# Altium schematic sheet uC.SchDoc
size 594 x 420 mm; Address1: Address1; Address2: Address2; Address3: Address3; Address4: Address4; SheetNumber: 1; Scale: 1:1; Разраб.: Иванов; Обозначение документа: uC; Пров.: Петров; Утв.: Сидоров; Наименование организации: ОАО "Концерн "МПО-Гидроприбор"; Перв. применение: АБВГ.123456.000; Наименование изделия 1: ujyjyjyj; Наименование изделия 2: Схема электрическая; Наименование изделия 3: принципиальная; Нач. отд.: Нач. отд.; Фамилия нач. отд.: Сидоров
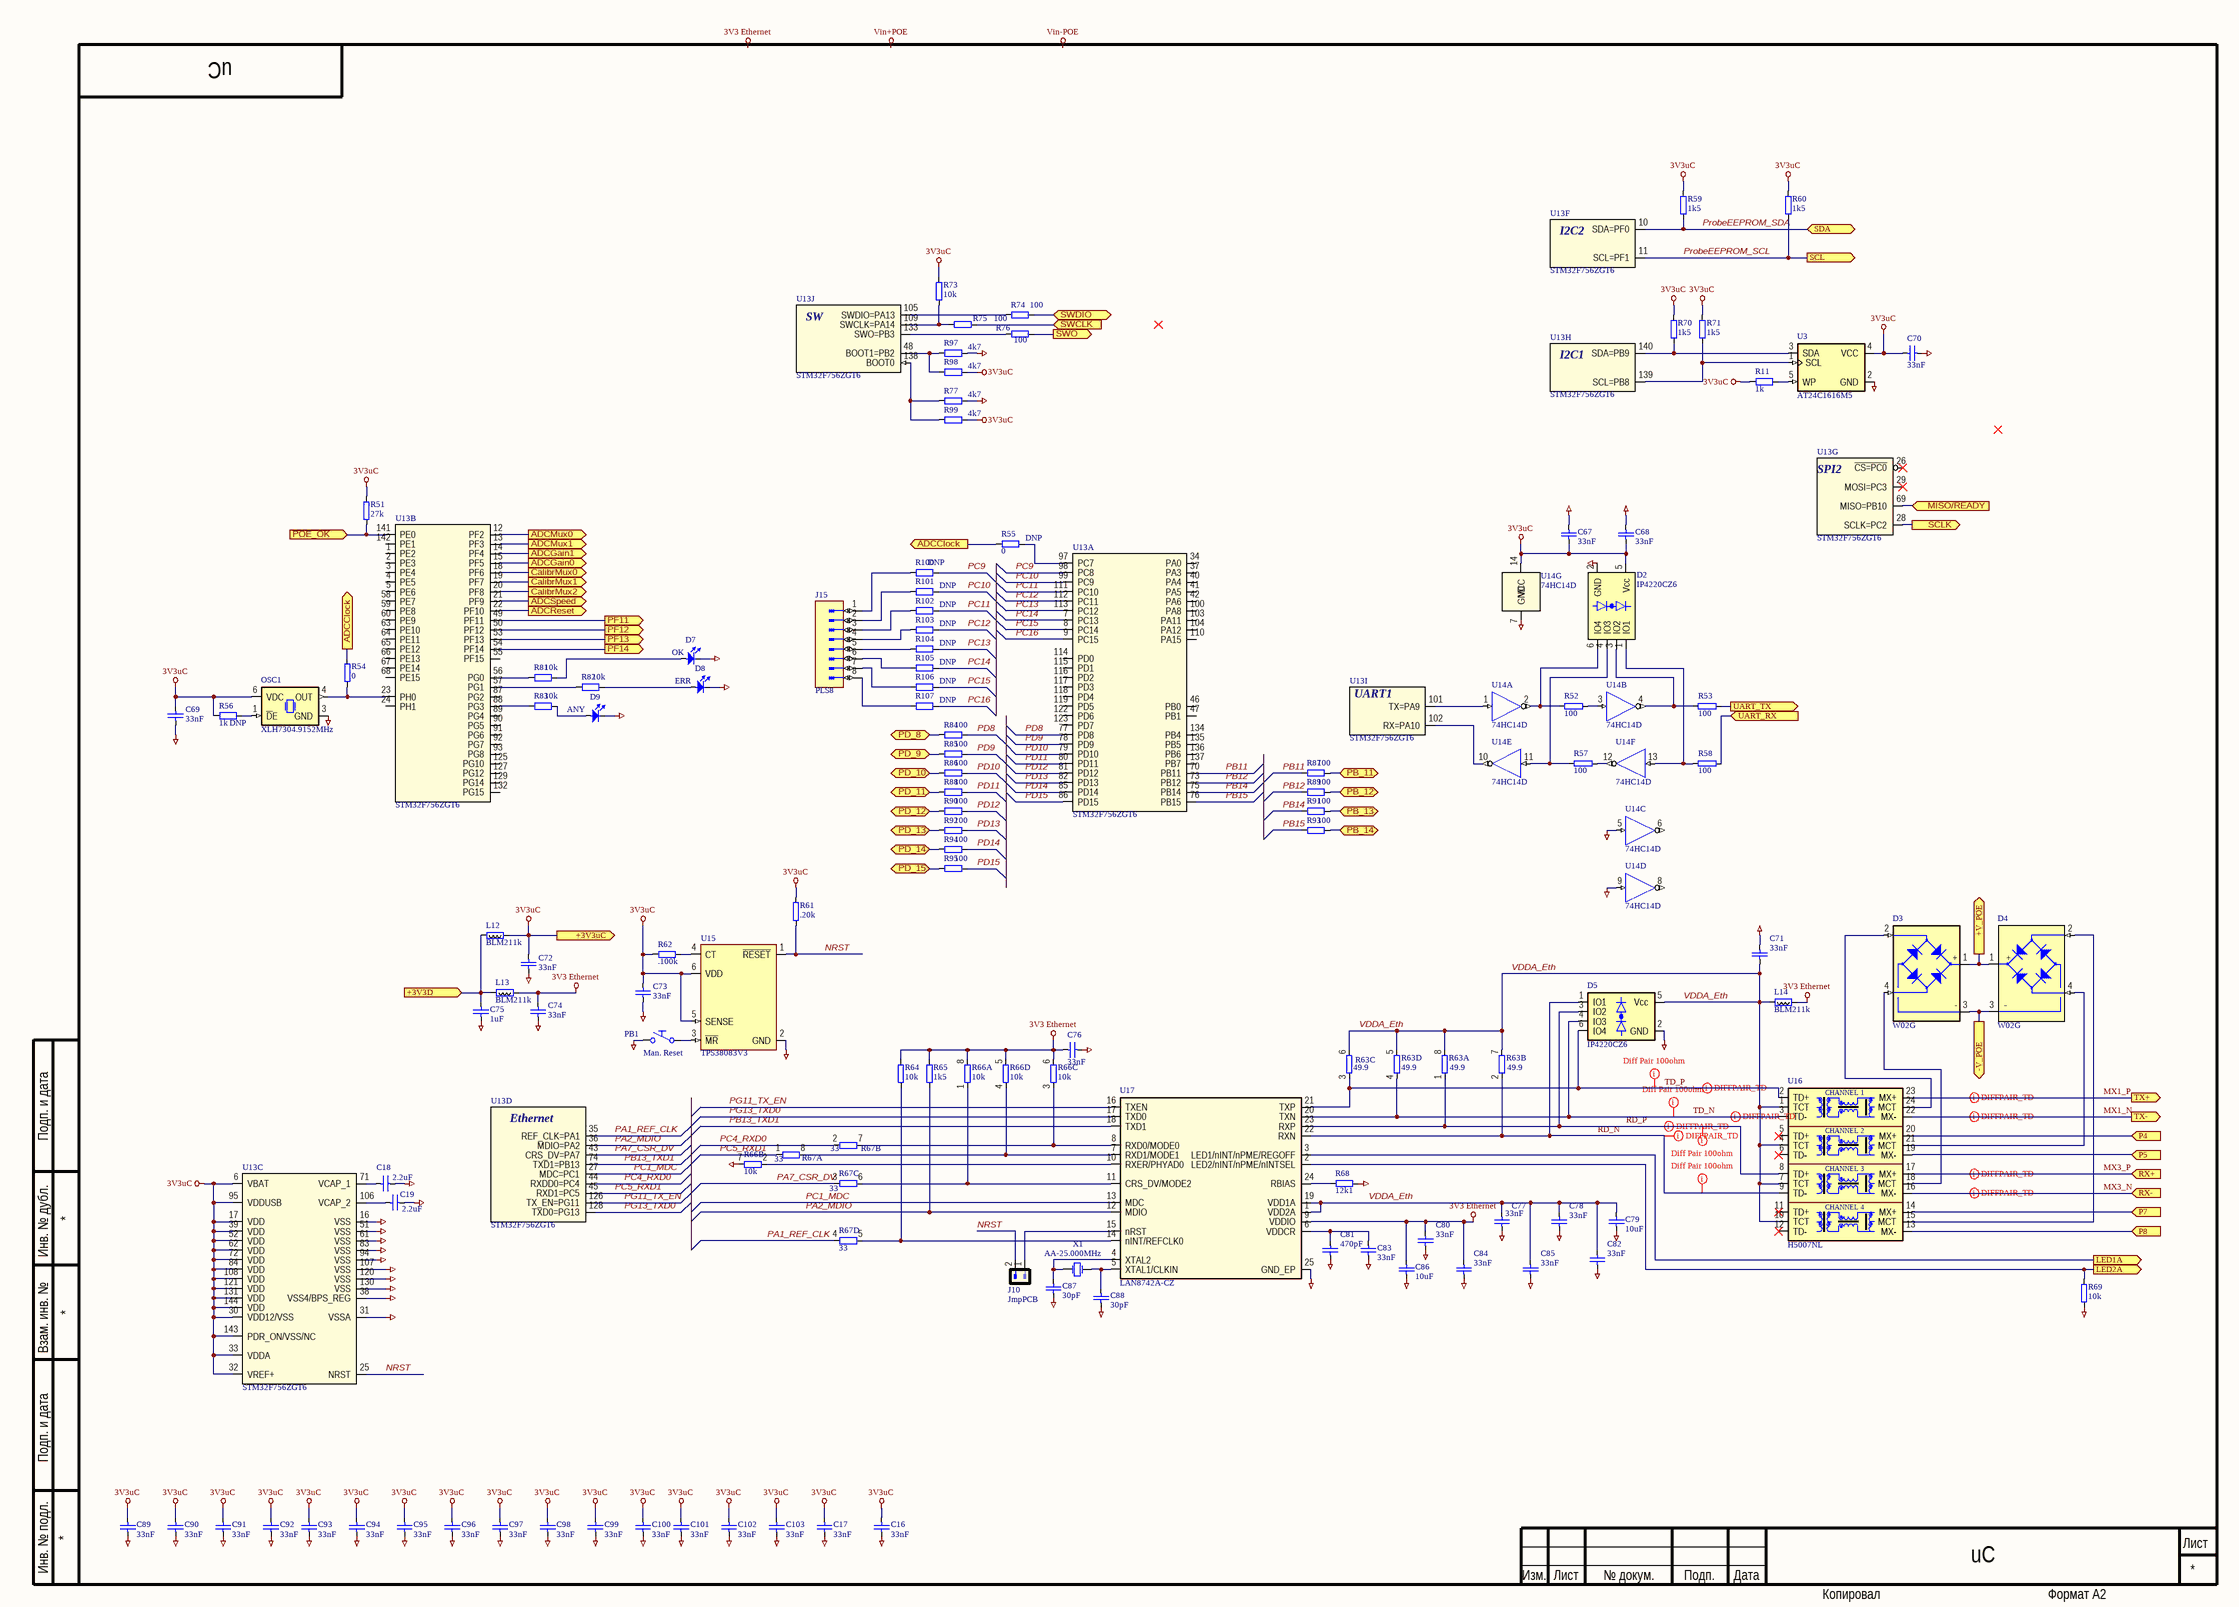
[diagram p0: uC.SchDoc]

## Parts
C16  33nF  [CAPC1608X87N]
C17  33nF  [CAPC1608X87N]
C18  2.2uF  [SMD0805CAP]
C19  2.2uF  [SMD0805CAP]
C67  33nF  [CAPC1608X87N]
C68  33nF  [CAPC1608X87N]
C69  33nF  [CAPC1608X87N]
C70  33nF  [CAPC1608X87N]
C71  33nF  [CAPC1608X87N]
C72  33nF  [CAPC1608X87N]
C73  33nF  [CAPC1608X87N]
C74  33nF  [CAPC1608X87N]
C75  1uF  [CAPC1608X87N]
C76  33nF  [CAPC1608X87N]
C77  33nF  [CAPC1608X87N]
C78  33nF  [CAPC1608X87N]
C79  10uF  [SMD0805CAP]
C80  33nF  [CAPC1608X87N]
C81  470pF  [CAPC1608X87N]
C82  33nF  [CAPC1608X87N]
C83  33nF  [CAPC1608X87N]
C84  33nF  [CAPC1608X87N]
C85  33nF  [CAPC1608X87N]
C86  10uF  [SMD0805CAP]
C87  30pF  [CAPC1608X87N]
C88  30pF  [CAPC1608X87N]
C89  33nF  [CAPC1608X87N]
C90  33nF  [CAPC1608X87N]
C91  33nF  [CAPC1608X87N]
C92  33nF  [CAPC1608X87N]
C93  33nF  [CAPC1608X87N]
C94  33nF  [CAPC1608X87N]
C95  33nF  [CAPC1608X87N]
C96  33nF  [CAPC1608X87N]
C97  33nF  [CAPC1608X87N]
C98  33nF  [CAPC1608X87N]
C99  33nF  [CAPC1608X87N]
C100  33nF  [CAPC1608X87N]
C101  33nF  [CAPC1608X87N]
C102  33nF  [CAPC1608X87N]
C103  33nF  [CAPC1608X87N]
D2  IP4220CZ6  [SOT95P270X145-6N]
D3  W02G  [RECTRON_RB15]
D4  W02G  [RECTRON_RB15]
D5  IP4220CZ6  [SOT95P270X145-6N]
D7  OK  [LED_OSRAM_LGR971]
D8  ERR  [LED_OSRAM_LOR976]
D9  ANY  [LED_OSRAM_LYR976]
J10  JmpPCB  [PCBJumper]
J15  PLS8  [COMATEL_386.0358.1.08.440]
L12  BLM211k  [RESC2012X50N]
L13  BLM211k  [RESC2012X50N]
L14  BLM211k  [RESC2012X50N]
OSC1  XLH7304.9152MHz  [OSC_PERICOM_FRETHE025]
PB1  value Man. Reset  [PB_ALPS_SKHHLQA010]  (hidden comment: 2-1825027-0)
R11  1k  [SMD0805RES]
R51  27k  [SMD0805RES]
R52  100  [SMD0805RES]
R53  100  [SMD0805RES]
R54  0  [SMD0805RES]
R55  0  Solder Option: DNP  [SMD0805RES]
R56  1k  Solder Option: DNP  [SMD0805RES]
R57  100  [SMD0805RES]
R58  100  [SMD0805RES]
R59  1k5  [RESC1608X64N]
R60  1k5  [RESC1608X64N]
R61  .20k  [RESC1608X64N]
R62  .100k  [RESC1608X64N]
R63  49.9  [CAY16x4]  (parts A,B,C,D of 4)
R64  10k  [RESC1608X64N]
R65  1k5  [RESC1608X64N]
R66  10k  [CAY16x4]  (parts A,B,C,D of 4)
R67  33  [CAY16x4]  (parts A,B,C,D of 4)
R68  12k1  [RESC1608X64N]
R69  10k  [RESC1608X64N]
R70  1k5  [RESC1608X64N]
R71  1k5  [SMD0805RES]
R73  10k  [SMD0805RES]
R74  100  [SMD0805RES]
R75  100  [SMD0805RES]
R76  100  [SMD0805RES]
R77  4k7  [RESC1608X64N]
R81  10k  [SMD0805RES]
R82  10k  [SMD0805RES]
R83  10k  [SMD0805RES]
R84  100  [SMD0805RES]
R85  100  [SMD0805RES]
R86  100  [SMD0805RES]
R87  100  [SMD0805RES]
R88  100  [SMD0805RES]
R89  100  [SMD0805RES]
R90  100  [SMD0805RES]
R91  100  [SMD0805RES]
R92  100  [SMD0805RES]
R93  100  [SMD0805RES]
R94  100  [SMD0805RES]
R95  100  [SMD0805RES]
R97  4k7  [RESC1608X64N]
R98  4k7  [RESC1608X64N]
R99  4k7  [RESC1608X64N]
R100  DNP  [RESC1608X64N]
R101  DNP  [RESC1608X64N]
R102  DNP  [RESC1608X64N]
R103  DNP  [RESC1608X64N]
R104  DNP  [RESC1608X64N]
R105  DNP  [RESC1608X64N]
R106  DNP  [RESC1608X64N]
R107  DNP  [RESC1608X64N]
U3  AT24C1616M5  [SOT23-5]
U13  STM32F756ZGT6  [LQFP-144_STM-M]  (parts A,B,C,D,F,G,H,I,J of 10)
U14  74HC14D  [SOIC127P600X175-14N]  (parts A,B,C,D,E,F,G of 7)
U15  TPS38083V3  [SOT95P270X145-6N]
U16  H5007NL  [XFMR_PULSE_H5007NL]
U17  LAN8742A-CZ  [QFN24_0R5_4X4]
X1  AA-25.000MHz  [XTAL_AA]

## Ports
+3V3D (in), +3V3uC (out), +V_POE (out), -V_POE (out), ADCClock (out), ADCGain0 (out), ADCGain1 (out), ADCMux0 (out), ADCMux1 (out), ADCReset (out), ADCSpeed (out), CalibrMux0 (out), CalibrMux1 (out), CalibrMux2 (out), LED1A (out), LED2A (out), MISO/READY (in), P4 (in), P5 (in), P7 (in), P8 (in), PB_11 (bidir), PB_12 (bidir), PB_13 (bidir), PB_14 (bidir), PD_8 (bidir), PD_9 (bidir), PD_10 (bidir), PD_11 (bidir), PD_12 (bidir), PD_13 (bidir), PD_14 (bidir), PD_15 (bidir), PF11 (out), PF12 (out), PF13 (out), PF14 (out), RX+ (in), RX- (in), SCL (out), SCLK (out), SDA (bidir), SWCLK (in), SWDIO (bidir), SWO (out), TX+ (out), TX- (out), UART_RX (in), UART_TX (out), ~{POE_OK} (in)

## Nets
3V3 Ethernet: C74.2 C76.2 C80.2 C84.2 C86.2 L13.2 L14.2 R64.1 R65.1 R66.5 R66.6 R66.8 U17.9(VDDIO)
3V3uC: C16.2 C17.2 C67.2 C68.2 C69.2 C70.1 C72.2 C73.2 C89.2 C90.2 C91.2 C92.2 C93.2 C94.2 C95.2 C96.2 C97.2 C98.2 C99.2 C100.2 C101.2 C102.2 C103.2 D2.5(Vcc) L12.2 OSC1.6(VDC) R11.2 R51.2 R56.1 R59.1 R60.1 R61.1 R62.1 R70.2 R71.2 R73.2 R98.2 R99.2 U3.4(VCC) U13.6(VBAT) U13.17(VDD) U13.30(VDD12/VSS) U13.32(VREF+) U13.33(VDDA) U13.39(VDD) U13.52(VDD) U13.62(VDD) U13.72(VDD) U13.84(VDD) U13.95(VDDUSB) U13.108(VDD) U13.121(VDD) U13.131(VDD) U13.143(PDR_ON/VSS/NC) U13.144(VDD) U14.14(VCC) U15.5(SENSE) U15.6(VDD) ; port +3V3uC
GND: C16.1 C17.1 C18.1 C19.1 C67.1 C68.1 C69.1 C70.2 C71.2 C72.1 C73.1 C74.1 C75.1 C76.1 C77.1 C78.1 C79.1 C80.1 C81.1 C82.1 C83.1 C84.1 C85.1 C86.1 C87.2 C88.2 C89.1 C90.1 C91.1 C92.1 C93.1 C94.1 C95.1 C96.1 C97.1 C98.1 C99.1 C100.1 C101.1 C102.1 C103.1 D2.2(GND) D5.2(GND) D7.1(C) D8.1(C) D9.1(C) OSC1.3(GND) PB1.2(NO) R66.7 R68.1 R69.2 R77.2 R97.2 U3.2(GND) U13.16(VSS) U13.31(VSSA) U13.38(VSS4/BPS_REG) U13.51(VSS) U13.61(VSS) U13.83(VSS) U13.94(VSS) U13.107(VSS) U13.120(VSS) U13.130(VSS) U14.5(IN) U14.7(GND) U14.9(IN) U15.2(GND) U17.25(GND_EP)
+3V3D: C75.2 L12.1 L13.1 ; port +3V3D
+V_POE: D3.1(+) D4.1(+) ; port +V_POE
-V_POE: D3.3(-) D4.3(-) ; port -V_POE
~{POE_OK}: R51.1 U13.141(PE0) ; port ~{POE_OK}
ADCClock: R54.2 R55.2 ; port ADCClock
ADCGain0: U13.15(PF5) ; port ADCGain0
ADCGain1: U13.14(PF4) ; port ADCGain1
ADCMux0: U13.12(PF2) ; port ADCMux0
ADCMux1: U13.13(PF3) ; port ADCMux1
ADCReset: U13.22(PF10) ; port ADCReset
ADCSpeed: U13.21(PF9) ; port ADCSpeed
CalibrMux0: U13.18(PF6) ; port CalibrMux0
CalibrMux1: U13.19(PF7) ; port CalibrMux1
CalibrMux2: U13.20(PF8) ; port CalibrMux2
LED1A: U17.3(LED1/nINT/nPME/REGOFF) ; port LED1A
LED2A: R69.1 U17.2(LED2/nINT/nPME/nINTSEL) ; port LED2A
MISO/READY: U13.69(MISO=PB10) ; port MISO/READY
MX1_N: U16.22(MX-) ; port TX-
MX1_P: U16.23(MX+) ; port TX+
MX3_N: U16.16(MX-) ; port RX-
MX3_P: U16.17(MX+) ; port RX+
NRST: J10.2 R61.2 U13.25(NRST) U15.1(~{RESET})
P4: U16.20(MX+) ; port P4
P5: U16.19(MX-) ; port P5
P7: U16.14(MX+) ; port P7
P8: U16.13(MX-) ; port P8
PA1_REF_CLK: R67.4 U13.35(REF_CLK=PA1)
PA2_MDIO: R65.2 U13.36(MDIO=PA2) U17.12(MDIO)
PA7_CSR_DV: R67.3 U13.43(CRS_DV=PA7)
PB11: R87.1 U13.70(PB11)
PB12: R89.1 U13.73(PB12)
PB13_TXD1: U13.74(TXD1=PB13) U17.18(TXD1)
PB14: R91.1 U13.75(PB14)
PB15: R93.1 U13.76(PB15)
PB_11: R87.2 ; port PB_11
PB_12: R89.2 ; port PB_12
PB_13: R91.2 ; port PB_13
PB_14: R93.2 ; port PB_14
PC1_MDC: U13.27(MDC=PC1) U17.13(MDC)
PC4_RXD0: R67.2 U13.44(RXDD0=PC4)
PC5_RXD1: R67.1 U13.45(RXD1=PC5)
PC9: R100.2 U13.98(PC8)
PC10: R101.2 U13.99(PC9)
PC11: R102.2 U13.111(PC10)
PC12: R103.2 U13.112(PC11)
PC13: R104.2 U13.113(PC12)
PC14: R105.2 U13.7(PC13)
PC15: R106.2 U13.8(PC14)
PC16: R107.2 U13.9(PC15)
PD8: R84.2 U13.77(PD8)
PD9: R85.2 U13.78(PD9)
PD10: R86.2 U13.79(PD10)
PD11: R88.2 U13.80(PD11)
PD12: R90.2 U13.81(PD12)
PD13: R92.2 U13.82(PD13)
PD14: R94.2 U13.85(PD14)
PD15: R95.2 U13.86(PD15)
PD_8: R84.1 ; port PD_8
PD_9: R85.1 ; port PD_9
PD_10: R86.1 ; port PD_10
PD_11: R88.1 ; port PD_11
PD_12: R90.1 ; port PD_12
PD_13: R92.1 ; port PD_13
PD_14: R94.1 ; port PD_14
PD_15: R95.1 ; port PD_15
PF11: U13.49(PF11) ; port PF11
PF12: U13.50(PF12) ; port PF12
PF13: U13.53(PF13) ; port PF13
PF14: U13.54(PF14) ; port PF14
PG11_TX_EN: U13.126(TX_EN=PG11) U17.16(TXEN)
PG13_TXD0: U13.128(TXD0=PG13) U17.17(TXD0)
ProbeEEPROM_SCL: R60.2 U13.11(SCL=PF1) ; port SCL
ProbeEEPROM_SDA: R59.2 U13.10(SDA=PF0) ; port SDA
RD_N: D5.1(IO1) R63.2 U16.9(TD-) U17.22(RXN)
RD_P: D5.3(IO2) R63.1 U16.8(TD+) U17.23(RXP)
SCLK: U13.28(SCLK=PC2) ; port SCLK
SWCLK: R75.2 ; port SWCLK
SWDIO: R74.2 ; port SWDIO
SWO: R76.2 ; port SWO
TD_N: D5.4(IO3) R63.4 U16.3(TD-) U17.20(TXN)
TD_P: D5.6(IO4) R63.3 U16.2(TD+) U17.21(TXP)
UART_RX: R58.2 ; port UART_RX
UART_TX: R53.2 ; port UART_TX
VDDA_Eth: C71.1 C77.2 C78.2 C79.2 C82.2 C85.2 D5.5(Vcc) L14.1 R63.5 R63.6 R63.7 R63.8 U16.1(TCT) U16.4(TCT) U16.7(TCT) U16.10(TCT) U17.1(VDD2A) U17.19(VDD1A)
NetC18_2: C18.2 U13.71(VCAP_1)
NetC19_2: C19.2 U13.106(VCAP_2)
NetC81_2: C81.2 C83.2 U17.6(VDDCR)
NetC87_1: C87.1 U17.4(XTAL2) X1.1(OSC1)
NetC88_1: C88.1 U17.5(XTAL1/CLKIN) X1.2(OSC2)
NetD2_1: D2.1(IO1) R58.1 U14.13(IN)
NetD2_3: D2.3(IO2) R53.1 U14.4(OUT)
NetD2_4: D2.4(IO3) R57.1 U14.11(IN)
NetD2_6: D2.6(IO4) R52.1 U14.2(OUT)
NetD3_2: D3.2(AC) U16.24(MCT)
NetD3_4: D3.4(AC) U16.18(MCT)
NetD4_2: D4.2(AC) U16.15(MCT)
NetD4_4: D4.4(AC) U16.21(MCT)
NetD7_2: D7.2(A) R81.2
NetD8_2: D8.2(A) R82.2
NetD9_2: D9.2(A) R83.2
NetJ10_1: J10.1 U17.15(nRST)
NetJ15_1: J15.1 R100.1
NetJ15_2: J15.2 R101.1
NetJ15_3: J15.3 R102.1
NetJ15_4: J15.4 R103.1
NetJ15_5: J15.5 R104.1
NetJ15_6: J15.6 R105.1
NetJ15_7: J15.7 R106.1
NetJ15_8: J15.8 R107.1
NetOSC1_1: OSC1.1(~{D}E) R56.2
NetOSC1_4: OSC1.4(OUT) R54.1 U13.23(PH0)
NetPB1_1: PB1.1(C) U15.3(~{MR})
NetR11_1: R11.1 U3.5(WP)
NetR52_2: R52.2 U14.3(IN)
NetR55_1: R55.1 U13.97(PC7)
NetR57_2: R57.2 U14.12(OUT)
NetR62_2: R62.2 U15.4(CT)
NetR64_2: R64.2 R67.5 U17.14(nINT/REFCLK0)
NetR66_1: R66.1 R67.6 U17.11(CRS_DV/MODE2)
NetR66_2: R66.2 U17.10(RXER/PHYAD0)
NetR66_3: R66.3 R67.7 U17.8(RXD0/MODE0)
NetR66_4: R66.4 R67.8 U17.7(RXD1/MODE1)
NetR68_2: R68.2 U17.24(RBIAS)
NetR70_1: R70.1 U3.3(SDA) U13.140(SDA=PB9)
NetR71_1: R71.1 U3.1(SCL) U13.139(SCL=PB8)
NetR73_1: R73.1 R75.1 U13.109(SWCLK=PA14)
NetR74_1: R74.1 U13.105(SWDIO=PA13)
NetR76_1: R76.1 U13.133(SWO=PB3)
NetR77_1: R77.1 R99.1 U13.138(BOOT0)
NetR81_1: R81.1 U13.56(PG0)
NetR82_1: R82.1 U13.57(PG1)
NetR83_1: R83.1 U13.88(PG3)
NetR97_1: R97.1 R98.1 U13.48(BOOT1=PB2)
NetU13_101: U13.101(TX=PA9) U14.1(IN)
NetU13_102: U13.102(RX=PA10) U14.10(OUT)

Not connected (* = marked no-connect by the designer): U13 1(PE2) 2(PE3) 3(PE4) 4(PE5) 5(PE6) 24(PH1) 26(~{CS=PC0})* 29(MOSI=PC3)* 34(PA0) 37(PA3) 40(PA4) 41(PA5) 42(PA6) 46(PB0) 47(PB1) 55(PF15) 58(PE7) 59(PE8) 60(PE9) 63(PE10) 64(PE11) 65(PE12) 66(PE13) 67(PE14) 68(PE15) 87(PG2) 89(PG4) 90(PG5) 91(PG6) 92(PG7) 93(PG8) 100(PA8) 103(PA11) 104(PA12) 110(PA15) 114(PD0) 115(PD1) 116(PD2) 117(PD3) 118(PD4) 119(PD5) 122(PD6) 123(PD7) 125(PG10) 127(PG12) 129(PG14) 132(PG15) 134(PB4) 135(PB5) 136(PB6) 137(PB7) 142(PE1); U14 6(OUT) 8(OUT); U16 5(TD+)* 6(TD-)* 11(TD+)* 12(TD-)*

## Layout directives
differential pair: MX1_N, MX1_P, MX3_N, MX3_P, RD_N, RD_P, TD_N, TD_P
rule Matched Net Lengths [Tolerance = 100mil]: RD_N, RD_P, TD_N, TD_P

## Notes on the sheet
- Labels drawn without touching a wire or pin: 3V3 Ethernet, Vin+POE, Vin-POE
- Подп. и дата
- Инв. № дубл.
- Взам. инв. №
- Инв. № подл.
- Изм.
- Лист
- № докум.
- Подп.
- Дата
- Копировал
- Формат А2
- (in symbol H5007NL) CHANNEL 1; CHANNEL 2; CHANNEL 3; CHANNEL 4
- (in symbol STM32F756ZGT6, part D) Ethernet
- (in symbol STM32F756ZGT6, part F) I2C2
- (in symbol STM32F756ZGT6, part G) SPI2
- (in symbol STM32F756ZGT6, part H) I2C1
- (in symbol STM32F756ZGT6, part I) UART1
- (in symbol STM32F756ZGT6, part J) SW

## Library data of the parts
C16 C17 C67-C78 C80 C82-C85 C89-C103 = C0603: Чип конденсатор 0603; Voltage: 50V; Vendor: Vishay; DielectricType: X5R; SMD Solders: 2; Solder Option: RM; Tolerance: 20%; Pkg: SMD0603; Device: Cap603; Price: 2
  C16 C17 C67-C74 C76-C78 C80 C82-C85 C89-C103: Value: 33nF
  C75: Value: 1uF
C18 C19 C79 C86 = C0805: Чип конденсатор 0805; Voltage: 25V; Vendor: Vishay; DielectricType: X5R; SMD Solders: 2; Solder Option: RM; Tolerance: 20%; Pkg: SMD0805; Device: Cap0805; Price: 2
  C18 C19: Value: 2.2uF
  C79 C86: Value: 10uF
C81 C87 C88 = C0603: Чип конденсатор 0603; Voltage: 50V; Vendor: Vishay; DielectricType: NPO; SMD Solders: 2; Solder Option: RM; Tolerance: 20%; Pkg: SMD0603; Device: Cap603; Price: 2
  C81: Value: 470pF
  C87 C88: Value: 30pF
D2 D5 = IP4220: Optotransistor; Pkg: SOT23-6; SMD Solders: 6; Solder Option: RM; THD Solders: 0; Vendor: NXP; Voltage: 6V; Device: IP4220CZ6; Price: 10; Name to order: IP4220CZ6; Current: 0
D3 D4 = W02G: Diode Bridge Rectifier; Vendor: multicomp; SMD Solders: 0; Solder Option: RM; THD Solders: 4; Voltage: 200V; Pkg: W02G; Price: 20; Device: W02G; Name to order: W02G
D7-D9 = LED0805: Чип светодиод 0805; Vendor: KB; SMD Solders: 2; Solder Option: RM; Pkg: SMD0805; THD Solders: 0; Price: 10; Device: LED0805
  D7: Value: OK
  D8: Value: ERR
  D9: Value: ANY
J10 = JmpPCB: PLS2; SMD Solders: 1; Solder Option: i; THD Solders: 0; Price: 1; Vendor: -; Device: JmpPCB
J15 = PLS8: Вилка  PLS8/2.54; Vendor: Confly; SMD Solders: 0; Solder Option: RM; THD Solders: 8; Price: 20; Device: PLS8
L12-L14 = BLM21: SMD Ferrite bead 0805; Vendor: Vishay; Value: 1k; Pkg: SMD0805; SMD Solders: 2; Solder Option: RM; Price: 10; Device: BLM21
OSC1 = XLH730: Генератор кварцевый; Vendor: Renesas; Pkg: 7x5mm; SMD Solders: 2; Solder Option: RM; THD Solders: 0; Name to order: XLH730004.915200I; Value: 4.9152MHz; Price: 400; Device: XLH730; Current: 0
PB1 = PBAngle: Push Button Angle NO; Vendor: TE Conn; SMD Solders: 0; Solder Option: RM; Pkg: 7x7mm; THD Solders: 4; Price: 1; Device: PushButt; Name to order: 2-1825027-0
R11 R51-R54 R57 R58 R71 R73-R76 R81-R95 = R0805: Чип резистор 0805; Vendor: Vishay; SMD Solders: 2; Solder Option: RM; TC: 100ppm/C; Tolerance: 1%; Pkg: SMD0805; Pwr: 125mW; Device: Res0805; Price: 2
  R11: Value: 1k
  R51: Value: 27k
  R52 R53 R57 R58 R74-R76 R84-R95: Value: 100
  R54: Value: 0
  R71: Value: 1k5
  R73 R81-R83: Value: 10k
R55 R56 = R0805: Чип резистор 0805; Vendor: Vishay; SMD Solders: 2; TC: 100ppm/C; Tolerance: 1%; Pkg: SMD0805; Pwr: 125mW; Device: Res0805; Price: 2
  R55: Value: 0
  R56: Value: 1k
R59-R62 R64 R65 R68 R69 R77 R97-R99 = R0603: Чип резистор 0603; Vendor: Vishay; SMD Solders: 2; Solder Option: RM; TC: 100ppm/C; Tolerance: 1%; Pkg: SMD0603; Pwr: 60mW; Device: Res603; Price: 2
  R59 R60 R65: Value: 1k5
  R61: Value: .20k
  R62: Value: .100k
  R64 R69: Value: 10k
  R68: Value: 12k1
  R77 R97-R99: Value: 4k7
R63 = CAY16: Сборка из 4х чип резисторов; Vendor: Bourns; SMD Solders: 8; Solder Option: RM; TC: 200ppm/C; Tolerance: 5%; Pkg: so8-80; Pwr: 60mW; THD Solders: 0; Name to order: CAY16-510j4  or CAY16-510F4; Price: 2; Value: 49.9; Device: CAY16
R66 = CAY16: Сборка из 4х чип резисторов; Vendor: Bourns; SMD Solders: 8; Solder Option: RM; TC: 200ppm/C; Tolerance: 5%; Pkg: so8-80; Pwr: 60mW; THD Solders: 0; Name to order: CAY16-10k0j4; Price: 2; Value: 10k; Device: CAY16
R67 = CAY16: Сборка из 4х чип резисторов; Vendor: Bourns; SMD Solders: 8; Solder Option: RM; TC: 200ppm/C; Tolerance: 5%; Pkg: so8-80; Pwr: 60mW; THD Solders: 0; Name to order: CAY16-330j4; Price: 2; Value: 33; Device: CAY16
R70 = R0805: Чип резистор 0603; Vendor: Vishay; SMD Solders: 2; Solder Option: RM; TC: 100ppm/C; Tolerance: 1%; Pkg: SMD0603; Pwr: 60mW; Device: Res603; Price: 2; Value: 1k5
R100-R107 = R0603: Чип резистор 0603; Vendor: Vishay; SMD Solders: 2; TC: 100ppm/C; Tolerance: 1%; Pkg: SMD0603; Pwr: 60mW; Device: Res603; Price: 2; Value: DNP; Solder Option: DNP
U3 = AT24C: Isolateted DC DC 5V->5V or 3V3 60mA; Vendor: HGSemi; Value: 16M5; SMD Solders: 5; Solder Option: RM; THD Solders: 0; Name to order: AT24C16M5/TR; Current: 2uA/2mA; Pkg: SOT23-5; Price: 20; Device: AT24C16
U13 = STM32F756ZGT6: High-performance and DSP with FPU, Arm Cortex-M7 MCU with 1 Mbyte of Flash memory, 216 MHz CPU, Art Accelerator, L1 cache, HW crypto, SDRAM, TFT; Manufacturer_Name: STMicroelectronics; SMD Solders: 144; THD Solders: 0; Pkg: LQFP144; Copyright: Copyright (C) 2025 Ultra Librarian. All rights reserved.; Manufacturer_Part_Number: STM32F756ZGT6; Datasheet: https://www.st.com/resource/en/datasheet/stm32f756bg.pdf; RefDes: RefDes; Type: Type; `: *; Price: 4000
U14 = 74HC14D: 6 триггеров Шмита с инверсией.; Vendor: NXP; Pkg: SOIC14; SMD Solders: 14; Solder Option: RM; Voltage: 2.. 6V; Price: 50; Device: 74HC14D; Name to order: 74HC14D
U15 = TPS3808: Supervisory Circuit. Low-Quiescent-Current, Programmable-Delay; Vendor: Texas Instruments; Value: 3V3; Pkg: SOT23-6; SMD Solders: 6; Solder Option: RM; THD Solders: 0; Name to order: TPS3808G33DBV; Current: 6uA; thVoltage: 3070mV; Price: 200; Device: TPS3808
U16 = H5007NL: Ethernet transformer IEEE 802.3; Vendor: Yageo; Pkg: SO24-1.27; SMD Solders: 24; Solder Option: RM; THD Solders: 0; Price: 400; Device: H5007NL; Name to order: H5007NL; Current: 0
U17 = LAN8742: Supervisory Circuit. Low-Quiescent-Current, Programmable-Delay; Vendor: MicroChip; Pkg: VQFN25-0.50; SMD Solders: 25; Solder Option: i; THD Solders: 0; Current: 6uA; Price: 700; Device: LAN8742A-CZ; Name to order: LAN8742A-CZ
X1 = AA-25: Резонатор кварцевый; Vendor: TXS; Pkg: 5x3,2; SMD Solders: 2; Solder Option: RM; Device: AA-; THD Solders: 0; Name to order: AA-25.000MALE-T; Value: 25.000MHz; Price: 300; Current: 0